# EAGLE design TeensyZE (EAGLE 7.4.0)
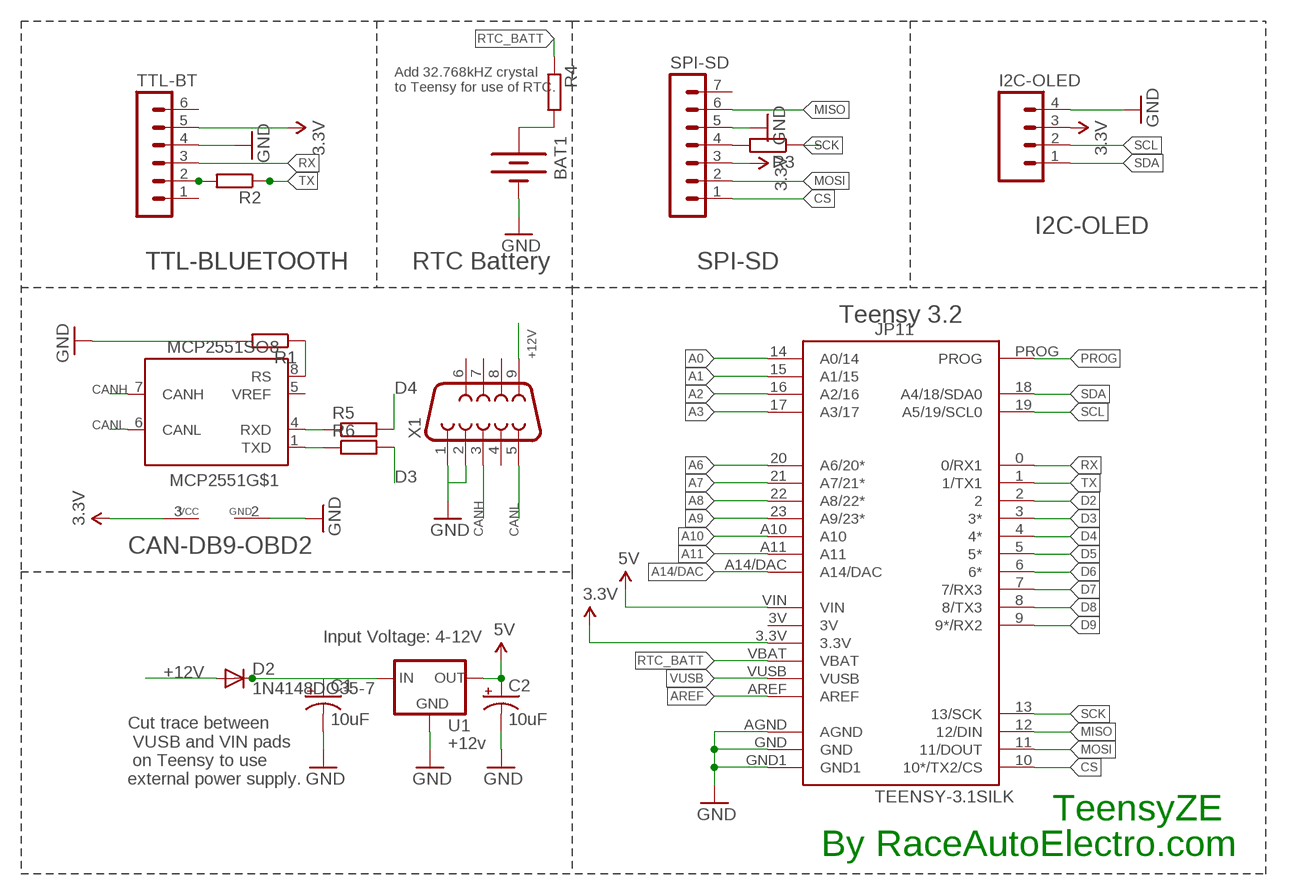
[diagram p0: schematic, sheet 1]

## Parts
BAT1  BATTERY12PTH  [BATTCON_12MM_PTH]
C1  10uF  10UF-25V-20%(PTH)  [CPOL-RADIAL-10UF-25V]
C2  10uF  10UF-25V-20%(PTH)  [CPOL-RADIAL-10UF-25V]
D2  1N4148DO35-7  [DO35-7]
I2C-OLED  M04PTH  [1X04]
JP11  TEENSY-3.1SILK  [TEENSY-3.1]
MCP2551  MCP2551SO8  [SO08]
R1  R-EU_R0805  [R0805]
R2  R-EU_R0805  [R0805]
R3  R-EU_R0805  [R0805]
R4  R-EU_R0805  [R0805]
R5  R-EU_R0805  [R0805]
R6  R-EU_R0805  [R0805]
SPI-SD  MA07-1  [MA07-1]
TTL-BT  MA06-1  [MA06-1]
U1  +12v  V_REG_78XX7812  [TO-252]
X1  F09HP  [F09HP]

## Nets
3.3V: I2C-OLED.3 JP11.3.3V MCP2551.3(VCC) SPI-SD.3 TTL-BT.5
5V: C2.1(+) JP11.VIN U1.2(OUT)
+12V: D2.A X1.9
A0: JP11.14(A0/14)
A1: JP11.15(A1/15)
A2: JP11.16(A2/16)
A3: JP11.17(A3/17)
A6: JP11.20(A6/20*)
A7: JP11.21(A7/21*)
A8: JP11.22(A8/22*)
A9: JP11.23(A9/23*)
A10: JP11.A10
A11: JP11.A11
A14/DAC: JP11.A14/DAC
AREF: JP11.AREF
CANH: MCP2551.7(CANH) X1.3
CANL: MCP2551.6(CANL) X1.5
CS: JP11.10(10*/TX2/CS) SPI-SD.1
D2: JP11.2
D3: JP11.3(3*) R6.2
D4: JP11.4(4*) R5.2
D5: JP11.5(5*)
D6: JP11.6(6*)
D7: JP11.7(7/RX3)
D8: JP11.8(8/TX3)
D9: JP11.9(9*/RX2)
GND: BAT1.GND(-) C1.2(-) C2.2(-) I2C-OLED.4 JP11.AGND JP11.GND JP11.GND1 MCP2551.2(GND) R1.2 SPI-SD.5 TTL-BT.4 U1.3(GND) X1.1 X1.2
MISO: JP11.12(12/DIN) SPI-SD.6
MOSI: JP11.11(11/DOUT) SPI-SD.2
N$1: MCP2551.8(RS) R1.1
N$2: R2.2 TTL-BT.2
N$3: R3.2 SPI-SD.4
N$5: MCP2551.4(RXD) R5.1
N$6: MCP2551.1(TXD) R6.1
N$7: BAT1.VCC@1(+) R4.2
PROG: JP11.PROG
RTC_BATT: JP11.VBAT R4.1
RX: JP11.0(0/RX1) TTL-BT.3
SCK: JP11.13(13/SCK) R3.1
SCL: I2C-OLED.2 JP11.19(A5/19/SCL0)
SDA: I2C-OLED.1 JP11.18(A4/18/SDA0)
TX: JP11.1(1/TX1) R2.1
VRAW: C1.1(+) D2.C U1.1(IN)
VUSB: JP11.VUSB
Unconnected: JP11.3V MCP2551.5(VREF) SPI-SD.7 TTL-BT.1 TTL-BT.6 X1.4 X1.6 X1.7 X1.8

## Notes on the sheet
- Add 32.768kHZ crystal 
  to Teensy for use of RTC.
- I2C-OLED
- TTL-BLUETOOTH | TTL-BLUETOOTH | RTC Battery | SPI-SD
- Teensy 3.2
- CAN-DB9-OBD2
- Input Voltage: 4-12V
- Cut trace between
   VUSB and VIN pads
   on Teensy to use 
  external power supply.
- TeensyZE
- By RaceAutoElectro.com

## Library data of the parts
BAT1 = SparkFun-Electromechanical:BATTERY: Battery Holders Various common sizes : AA, AAA, 18650 (PRT-12895), 20mm coin cell and 12mm coin cell. 20MM_4LEGS, BATT-10373; PROD_ID: BATT-08315
C1 C2 = SparkFun-Capacitors:10UF-25V-20%(PTH): CAP-08440; PROD_ID: CAP-08440
D2 = diode:1N4148: DIODE high speed (Philips)
I2C-OLED = SparkFun-Connectors:M04: Header 4 Standard 4-pin 0.1" header. Use with straight break away headers (SKU : PRT-00116), right angle break away headers (PRT-00553), swiss pins (PRT-00743), machine pins (PRT-00117), and female headers (PRT-00115). Molex polarized connector foot print use with SKU : PRT-08231 with associated crimp pins and housings. 1MM SMD Version SKU: PRT-10208
JP11 = Testing:TEENSY-3.1; SF_ID: DEV-12646
MCP2551 = can:MCP2551: CAN Tranceiver Microchip
R1-R6 = rcl:R-EU_: RESISTOR, European symbol
SPI-SD = con-lstb:MA07-1: PIN HEADER; OC_FARNELL: unknown; OC_NEWARK: unknown
TTL-BT = con-lstb:MA06-1: PIN HEADER; OC_FARNELL: unknown; OC_NEWARK: unknown
U1 = SparkFun-PowerIC:V_REG_78XX: Voltage Regulator Standard 78xx regulator. IGO (Input Ground Output). Spark Fun Electronics SKU : COM-00107; PROD_ID: VREG-12370
X1 = con-subd:F09: SUB-D; OC_FARNELL: unknown; OC_NEWARK: unknown

## Board
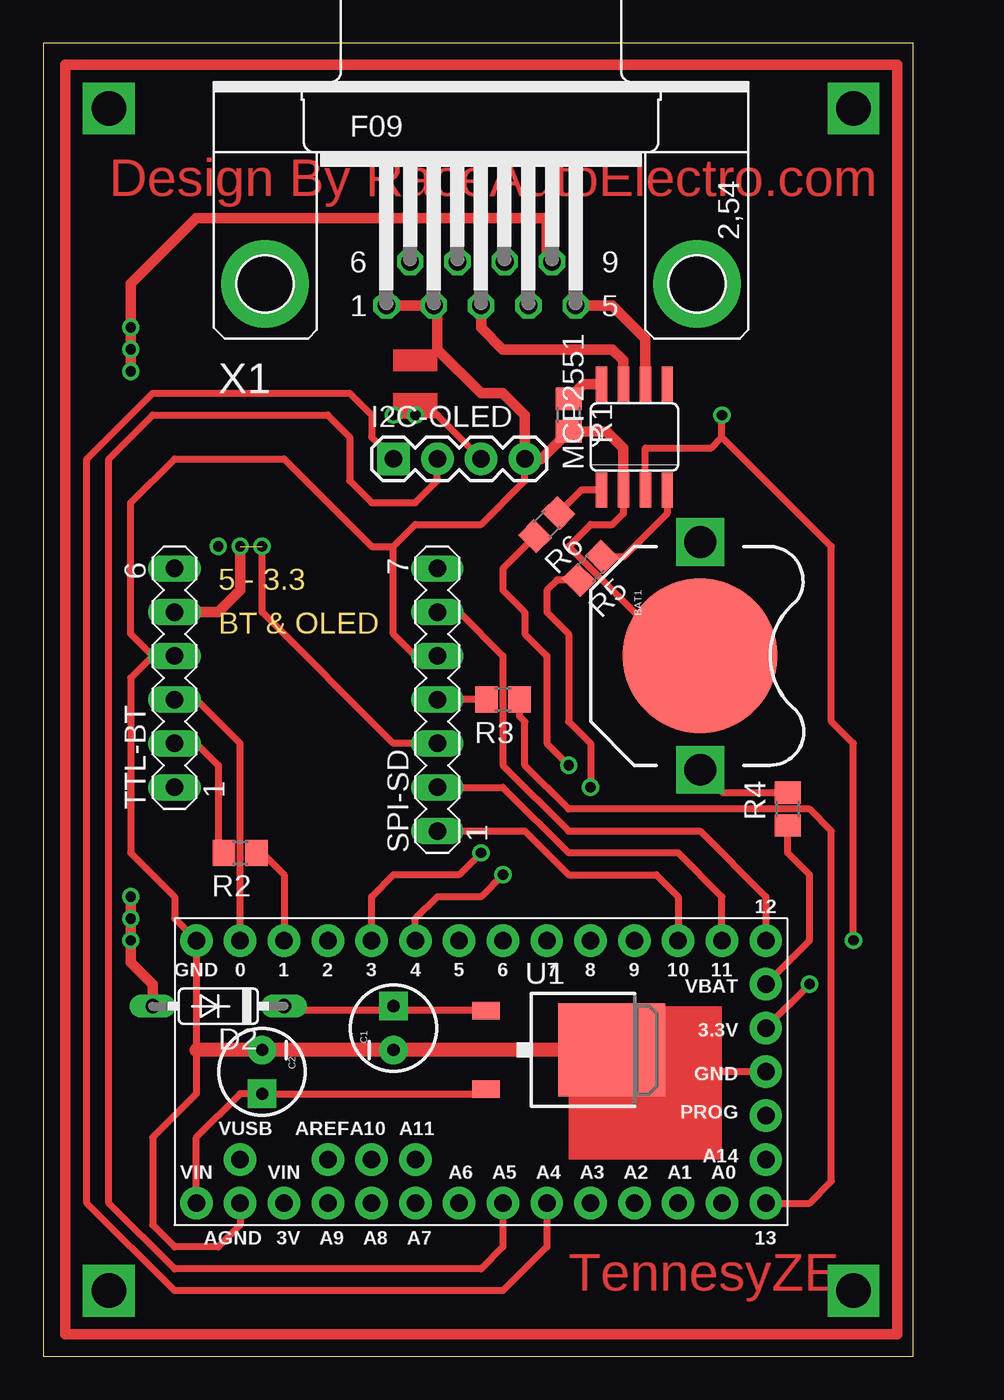
[diagram p1: board, top side]
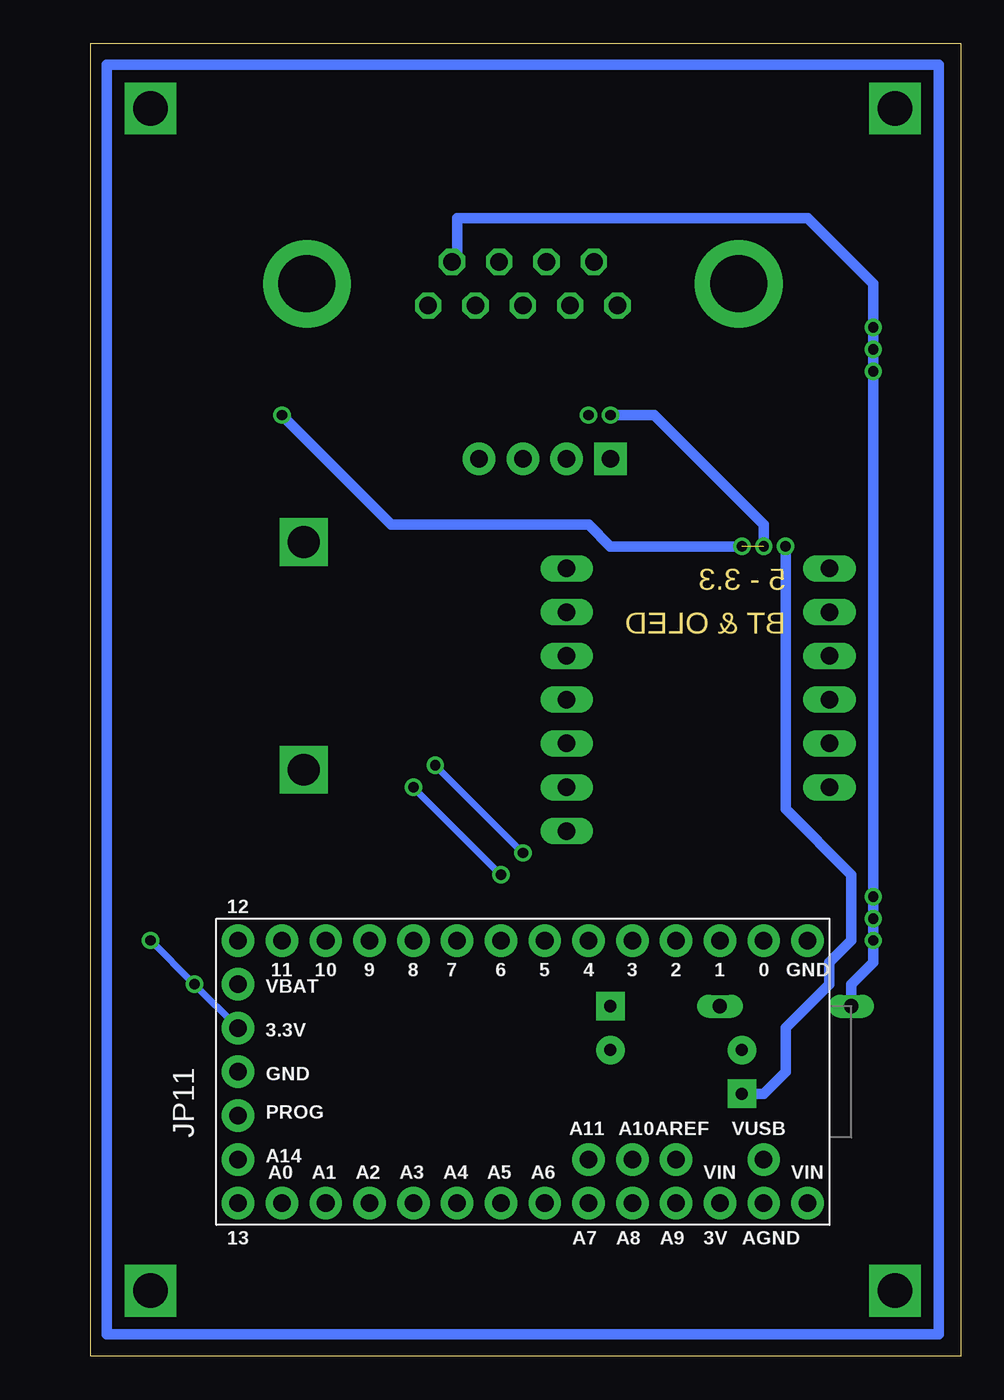
[diagram p2: board, bottom side, seen from below]

Size 50.47 x 76.19 mm. Coordinates in mm from the lower left corner, seen from the top.
Outline: 0,0 50.47,0 50.47,76.19 0,76.19 0,0
Copper layers (1*16): Top 0.035mm / dielectric 1.5mm / Bottom 0.035mm
Design rules "default": minimum track width 10mil, minimum drill 24mil, track to track 8mil, track to pad 8mil, pad to pad 8mil, via to via 8mil, smd to smd 8mil, copper to edge 40mil, drill to drill 8mil, minimum pad ring 10mil, minimum via ring 8mil, stop-mask expansion 4mil, vias tented up to drill 0mil, thermal gap 10mil

### Footprints (pad centres in the part's own frame; a part is rotated, then mirrored left to right if it is on the bottom)
BATTCON_12MM_PTH = smd 9 x 9: GND 0,0 | drill 1.854 square: VCC@1 6.604,0; VCC@2 -6.604,0
CPOL-RADIAL-10UF-25V = drill 0.7 pad 1.651 square: 1 1.27,0 | drill 0.7 pad 1.651: 2 -1.27,0
DO35-7 = drill 0.813 long: A 3.81,0; C -3.81,0
1X04 = drill 1.016 pad 1.88 square: 1 0,0 | drill 1.016 pad 1.88: 2 2.54,0; 3 5.08,0; 4 7.62,0
TEENSY-3.1 = drill 1.016 pad 1.88: 0 16.51,3.81; 1 16.51,6.35; 2 16.51,8.89; 3 16.51,11.43; 3.3V 11.43,34.29; 3V 1.27,6.35; 4 16.51,13.97; 5 16.51,16.51; 6 16.51,19.05; 7 16.51,21.59; 8 16.51,24.13; 9 16.51,26.67; 10 16.51,29.21; 11 16.51,31.75; 12 16.51,34.29; 13 1.27,34.29; 14 1.27,31.75; 15 1.27,29.21; 16 1.27,26.67; 17 1.27,24.13; 18 1.27,21.59; 19 1.27,19.05; 20 1.27,16.51; 21 1.27,13.97; 22 1.27,11.43; 23 1.27,8.89; A10 3.81,11.43; A11 3.81,13.97; A14/DAC 3.81,34.29; AGND 1.27,3.81; AREF 3.81,8.89; GND 8.89,34.29; GND1 16.51,1.27; PROG 6.35,34.29; VBAT 13.97,34.29; VIN 1.27,1.27; VUSB 3.81,3.81
SO08 = smd 0.66 x 2.032: 1 -1.905,-3.073; 2 -0.635,-3.073; 3 0.635,-3.073; 4 1.905,-3.073; 5 1.905,3.073; 6 0.635,3.073; 7 -0.635,3.073; 8 -1.905,3.073
R0805 = smd 1.3 x 1.5: 1 -0.95,0; 2 0.95,0
MA07-1 = drill 1.016 long: 1 -7.62,0; 2 -5.08,0; 3 -2.54,0; 4 0,0; 5 2.54,0; 6 5.08,0; 7 7.62,0
MA06-1 = drill 1.016 long: 1 -6.35,0; 2 -3.81,0; 3 -1.27,0; 4 1.27,0; 5 3.81,0; 6 6.35,0
TO-252 = smd 1 x 1.6: 1 -2.28,-4.8; 2 2.28,-4.8 | smd 5.4 x 6.2: 3 0,2.5
F09HP = drill 1.016 octagon: 1 -5.486,-1.27; 2 -2.743,-1.27; 3 0,-1.27; 4 2.743,-1.27; 5 5.486,-1.27; 6 -4.115,1.27; 7 -1.372,1.27; 8 1.372,1.27; 9 4.115,1.27 | drill 3.302 pad 5.08: G1 -12.522,0; G2 12.522,0

### Placement (x,y rotation side)
BAT1  38.1,40.64 270 top
C1  20.32,19.05 90 top
C2  12.7,16.51 270 top
D2  10.16,20.32 180 top
I2C-OLED  20.32,52.07 0 top
JP11  7.62,7.62 90 bottom
MCP2551  34.29,53.34 0 top
R1  30.48,54.61 270 top
R2  11.43,29.21 180 top
R3  26.67,38.1 180 top
R4  43.18,31.75 90 top
R5  31.75,45.72 225 top
R6  29.21,48.26 225 top
SPI-SD  22.86,38.1 90 top
TTL-BT  7.62,39.37 90 top
U1  30.48,17.78 270 top
X1  25.4,62.23 0 top

### Tracks (layer width: path | path; a pad name or v marks a point on that pad's centre or on a via)
3.3V  (via drill 0.6)  (1 unrouted)
  Top 0.406: SPI-SD.3 20.32,35.56 12.7,43.18 v12.7,46.99 | v46.99,24.13 46.99,35.56 45.72,36.83 45.72,46.99 39.37,53.34 | 39.37,53.34 v39.37,54.61 | MCP2551.3 34.92,52.71 38.73,52.71 39.37,53.34 | v20.32,54.61 v21.59,54.61 22.86,54.61 I2C-OLED.3 | JP11.3.3V v44.45,21.59
  Top 0.61: TTL-BT.5 10.16,43.18 11.43,44.45 v11.43,46.99
  Bottom 0.406: JP11.3.3V v44.45,21.59 v46.99,24.13
  Bottom 0.61: v12.7,46.99 20.32,46.99 21.59,48.26 33.02,48.26 v39.37,54.61 | v11.43,46.99 11.43,48.26 17.78,54.61 v20.32,54.61
5V  (via drill 0.6)
  Top 0.406: JP11.VIN 8.89,12.7 11.43,15.24 C2.1 25.42,15.24 U1.2
  Bottom 0.61: C2.1 11.43,15.24 10.16,16.51 10.16,19.05 7.62,21.59 7.62,22.86 6.35,24.13 6.35,27.94 10.16,31.75 v10.16,46.99
+12V  (via drill 0.6)
  Top 0.61: 29.21,63.5 29.21,66.04 8.89,66.04 5.08,62.23 v5.08,59.69 v5.08,58.42 v5.08,57.15 | D2.A 6.35,21.59 5.08,22.86 v5.08,26.67
  Bottom 0.61: D2.A 6.35,21.59 5.08,22.86 v5.08,24.13 v5.08,25.4 v5.08,26.67 v5.08,57.15 v5.08,58.42 v5.08,59.69 5.08,62.23 8.89,66.04 29.21,66.04 29.21,63.8 X1.9
CANH
  Top 0.61: MCP2551.7 33.66,57.79 33.02,58.42 26.67,58.42 25.4,59.69 X1.3
CANL
  Top 0.61: MCP2551.6 34.92,59.05 33.02,60.96 X1.5
CS
  Top 0.406: SPI-SD.1 27.94,30.48 30.48,27.94 35.56,27.94 36.83,26.67 JP11.10
D3  (via drill 0.6)
  Top 0.406: R6.2 26.67,45.72 26.67,44.45 27.94,43.18 27.94,41.91 29.21,40.64 29.21,35.56 v30.48,34.29 | v25.4,29.21 24.13,27.94 20.32,27.94 19.05,26.67 JP11.3
  Bottom 0.406: v25.4,29.21 v30.48,34.29
D4  (via drill 0.6)
  Top 0.406: R5.2 29.81,45.05 29.21,44.45 29.21,43.18 30.48,41.91 30.48,36.83 31.75,35.56 v31.75,33.02 | v26.67,27.94 25.4,26.67 22.86,26.67 21.59,25.4 JP11.4
  Bottom 0.406: v26.67,27.94 v31.75,33.02
GND
  Top 0.406: 6.35,40.64 5.08,39.37 5.08,29.21 7.62,26.67 7.62,25.4 JP11.GND1 8.89,17.78 | TTL-BT.4 6.35,40.64 | 6.35,40.64 5.08,41.91 5.08,49.53 7.62,52.07 13.97,52.07 19.05,46.99 20.32,46.99 | 20.32,60.96 20.32,61.37 X1.1 | BAT1.GND 36.83,40.64 30.48,46.99 31.75,48.26 33.02,48.26 33.66,48.9 MCP2551.2 | JP11.GND 34.25,16.51 U1.3 30.48,17.78 C1.2 C2.2 8.89,17.78 | 8.89,17.78 8.89,15.24 6.35,12.7 6.35,7.62 7.62,6.35 10.16,6.35 11.43,7.62 JP11.AGND | SPI-SD.5 21.59,40.64 20.32,41.91 20.32,46.99 | 20.32,46.99 21.59,48.26 25.4,48.26 27.94,50.8 I2C-OLED.4
  Top 0.61: MCP2551.2 33.66,52.71 32.7,53.66 R1.2 28.89,52.07 I2C-OLED.4 27.94,54.61 26.67,55.88 25.4,55.88 22.86,58.42 22.86,60.76 X1.2 20.32,60.96 X1.1
  Top 0.813: 30.48,17.78 8.89,17.78
MISO
  Top 0.406: SPI-SD.6 24.13,43.18 26.67,40.64 26.67,34.29 30.48,30.48 38.1,30.48 41.91,26.67 JP11.12
MOSI
  Top 0.406: SPI-SD.2 26.67,33.02 30.48,29.21 36.83,29.21 39.37,26.67 JP11.11
N$1
  Top 0.61: MCP2551.8 31.33,56.41 R1.1
N$2
  Top 0.406: TTL-BT.2 8.89,35.56 10.16,34.29 10.16,29.53 R2.2
N$3
  Top 0.406: R3.2 SPI-SD.4
N$4  (via drill 2)
  other vias: 3.81,3.81
N$5
  Top 0.406: R5.1 33.69,46.39 36.19,48.9 MCP2551.4
N$6
  Top 0.406: MCP2551.1 31.22,50.27 R6.1
N$7
  Top 0.406: R4.2 39.44,32.7 BAT1.VCC@1
N$8  (via drill 2)
  other vias: 46.99,3.81
N$9  (via drill 2)
  other vias: 46.99,72.39
N$10  (via drill 2)
  other vias: 3.81,72.39
N$11
  Top 0.61: 1.27,74.93 49.53,74.93 49.53,1.27 1.27,1.27 1.27,74.93
N$12
  Bottom 0.61: 49.53,74.93 49.53,1.27 1.27,1.27 1.27,74.93 49.53,74.93
RTC_BATT
  Top 0.406: JP11.VBAT 44.45,24.13 44.45,27.94 43.18,29.21 R4.1
RX
  Top 0.406: JP11.0 11.43,35.56 8.89,38.1 TTL-BT.3
SCK
  Top 0.406: JP11.13 44.45,8.89 45.72,10.16 45.72,30.48 44.45,31.75 30.48,31.75 27.94,34.29 27.94,36.83 27.62,37.15 R3.1
SCL
  Top 0.406: JP11.19 26.67,6.35 25.4,5.08 7.62,5.08 3.81,8.89 3.81,52.07 6.35,54.61 16.51,54.61 17.78,53.34 17.78,50.8 19.05,49.53 21.59,49.53 22.86,50.8 I2C-OLED.2
SDA
  Top 0.406: JP11.18 29.21,6.35 26.67,3.81 7.62,3.81 2.54,8.89 2.54,52.07 6.35,55.88 17.78,55.88 19.05,54.61 19.05,53.34 I2C-OLED.1
TX
  Top 0.406: R2.1 12.7,29.21 13.97,27.94 JP11.1
VRAW
  Top 0.406: U1.1 20.58,20.06 | 20.58,20.06 C1.1 | 20.58,20.06 14.23,20.06 D2.C
(copper drawn outside any net)
  shapes: Top area x3

### Text on the board
Top: Design By RaceAutoElectro.com | TennesyZE
Dimension: 5 - 3.3 | BT & OLED